# Altium schematic sheet sch.SchDoc
size A3
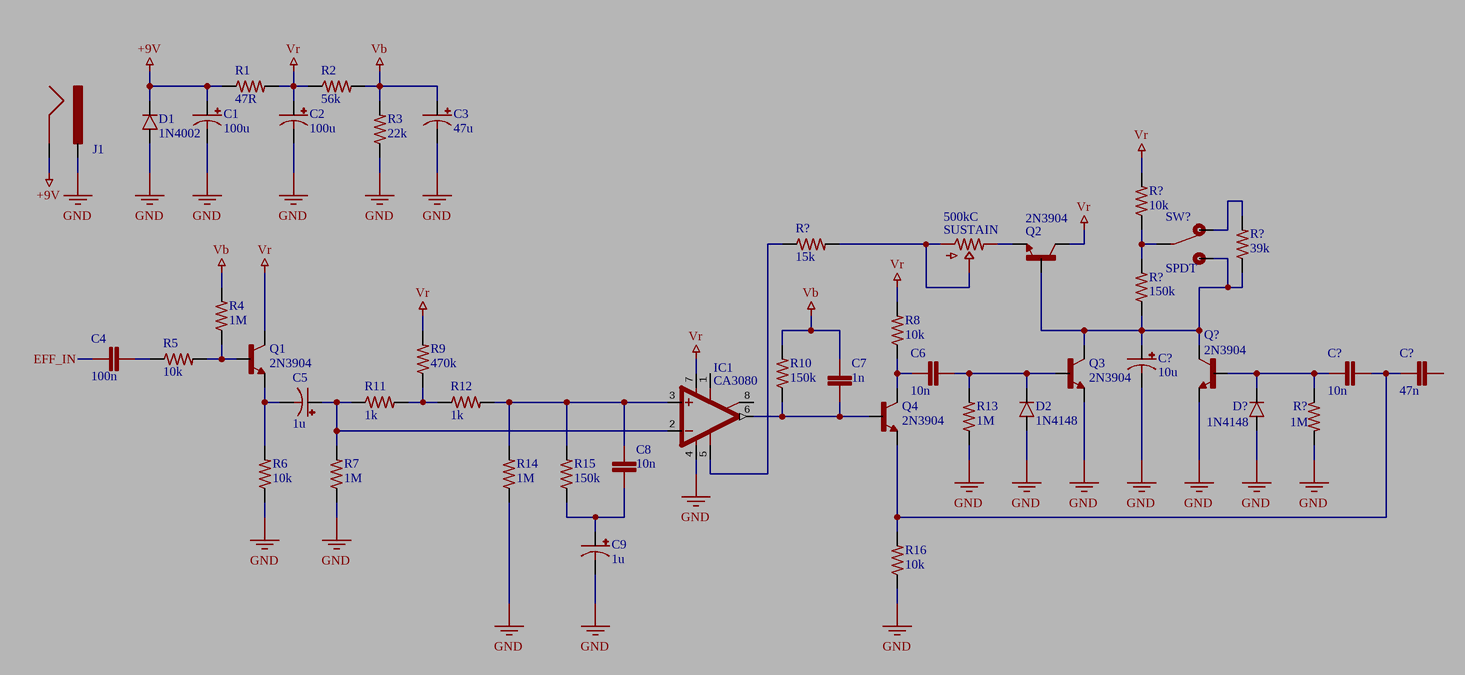
[diagram p0: sch.SchDoc]

## Parts
(Parts that share a designator on the sheet are numbered #1, #2 ... from top to bottom, then left to right.)
C1  100u  [ELEC_050_020]
C2  100u  [ELEC_050_020]
C3  47u  [ELEC_050_020]
C4  100n  [FILMBOX_SMALL]
C5  1u  [ELEC_LESR_040_020]
C6  10n  [FILMBOX_SMALL]
C7  1n  [FILMBOX_SMALL]
C8  10n  [FILMBOX_SMALL]
C9  1u  [ELEC_LESR_040_020]
C?#1  10u  [ELEC_LESR_050_020]
C?#2  10n  [FILMBOX_SMALL]
C?#3  47n  [FILMBOX_SMALL]
D1  1N4002  [DO41_2]
D2  1N4148
D?  1N4148
IC1  CA3080  [DIP8]
J1  DC_JACK  (value not drawn)
Q1  2N3904  [TO92]
Q2  2N3904  [TO92]
Q3  2N3904  [TO92]
Q4  2N3904  [TO92]
Q?  2N3904  [TO92]
R1  47R  [R_3_47R_025W]
R2  56k  [R_3_56k_025W]
R3  22k  [R_3_22k_025W]
R4  1M  [R_3_1M_025W]
R5  10k  [R_3_10k_025W]
R6  10k  [R_3_10k_025W]
R7  1M  [R_3_1M_025W]
R8  10k  [R_3_10k_025W]
R9  470k  [R_3_470k_025W]
R10  150k  [R_3_150k_025W]
R11  1k  [R_3_1k_025W]
R12  1k  [R_3_1k_025W]
R13  1M  [R_3_1M_025W]
R14  1M  [R_3_1M_025W]
R15  150k  [R_3_150k_025W]
R16  10k  [R_3_10k_025W]
R?#1  10k  [R_3_10k_025W]
R?#2  15k  [R_3_15k_025W]
R?#3  39k  [R_3_39k_025W]
R?#4  150k  [R_3_150k_025W]
R?#5  1M  [R_3_1M_025W]
SUSTAIN  500kC  [ALPHA_16mm]
SW?  SPDT  [SPDT]

## Nets
+9V: C1.+ D1.C J1.GND R1.1
GND: C1.- C2.- C3.- C9.- C?#1.- D1.A D2.A D?.A IC1.4(V-) J1.PWR Q3.3(E) Q?.3(E) R3.1 R6.1 R7.1 R13.1 R14.1 R16.1 R?#5.2
Vb: C3.+ C7.1 R2.2 R3.2 R4.2 R10.2
Vr: C2.+ IC1.7(V+) Q1.1(C) Q2.1(C) R1.2 R2.1 R8.2 R9.2 R?#1.2
EFF_IN: C4.2
NetC4_1: C4.1 R5.1
NetC5_+: C5.+ IC1.2(-IN) R7.2 R11.1
NetC5_-: C5.- Q1.3(E) R6.2
NetC6_1: C6.1 D2.C Q3.2(B) R13.2
NetC6_2: C6.2 Q4.1(C) R8.1
NetC7_2: C7.2 IC1.6(OUT) Q4.2(B) R10.1
NetC8_1: C8.1 IC1.3(+IN) R12.2 R14.2 R15.2
NetC8_2: C8.2 C9.+ R15.1
NetC?#1_+: C?#1.+ Q2.2(B) Q3.1(C) Q?.1(C) R?#3.1 R?#4.1 SW?.3(S)
NetC?#2_1: C?#2.1 C?#3.2 Q4.3(E) R16.2
NetC?#2_2: C?#2.2 D?.C Q?.2(B) R?#5.1
NetIC1_5: IC1.5(OPT) R?#2.1
NetQ1_2: Q1.2(B) R4.1 R5.2
NetQ2_3: Q2.3(E) SUSTAIN.3
NetR9_1: R9.1 R11.2 R12.1
NetR?#1_1: R?#1.1 R?#4.2 SW?.2(P)
NetR?#2_2: R?#2.2 SUSTAIN.1 SUSTAIN.2
NetR?#3_2: R?#3.2 SW?.1(O)

Not connected (* = marked no-connect by the designer): C?#3 1; IC1 1(ON1) 8(ON2)

## Library data of the parts
C1 C2 = ELEC_100u_16V
C3 = ELEC_47u_25V
C4 = FILMBOX_100n
C5 C9 = ELEC_LESR_1u_50V
C6 C8 C?#2 = FILMBOX_10n
C7 = FILMBOX_1n
C?#1 = ELEC_LESR_10u_50V
C?#3 = FILMBOX_47n
R1 = R_3_47R_025W
R2 = R_3_56k_025W
R3 = R_3_22k_025W
R4 R7 R13 R14 R?#5 = R_3_1M_025W
R5 R6 R8 R16 R?#1 = R_3_10k_025W
R9 = R_3_470k_025W
R10 R15 R?#4 = R_3_150k_025W
R11 R12 = R_3_1k_025W
R?#2 = R_3_15k_025W
R?#3 = R_3_39k_025W
SUSTAIN = ALPHA_16mm
SW? = SPDT_ON-OFF-ON